# Altium schematic sheet som.SchDoc
size 420 x 297 mm
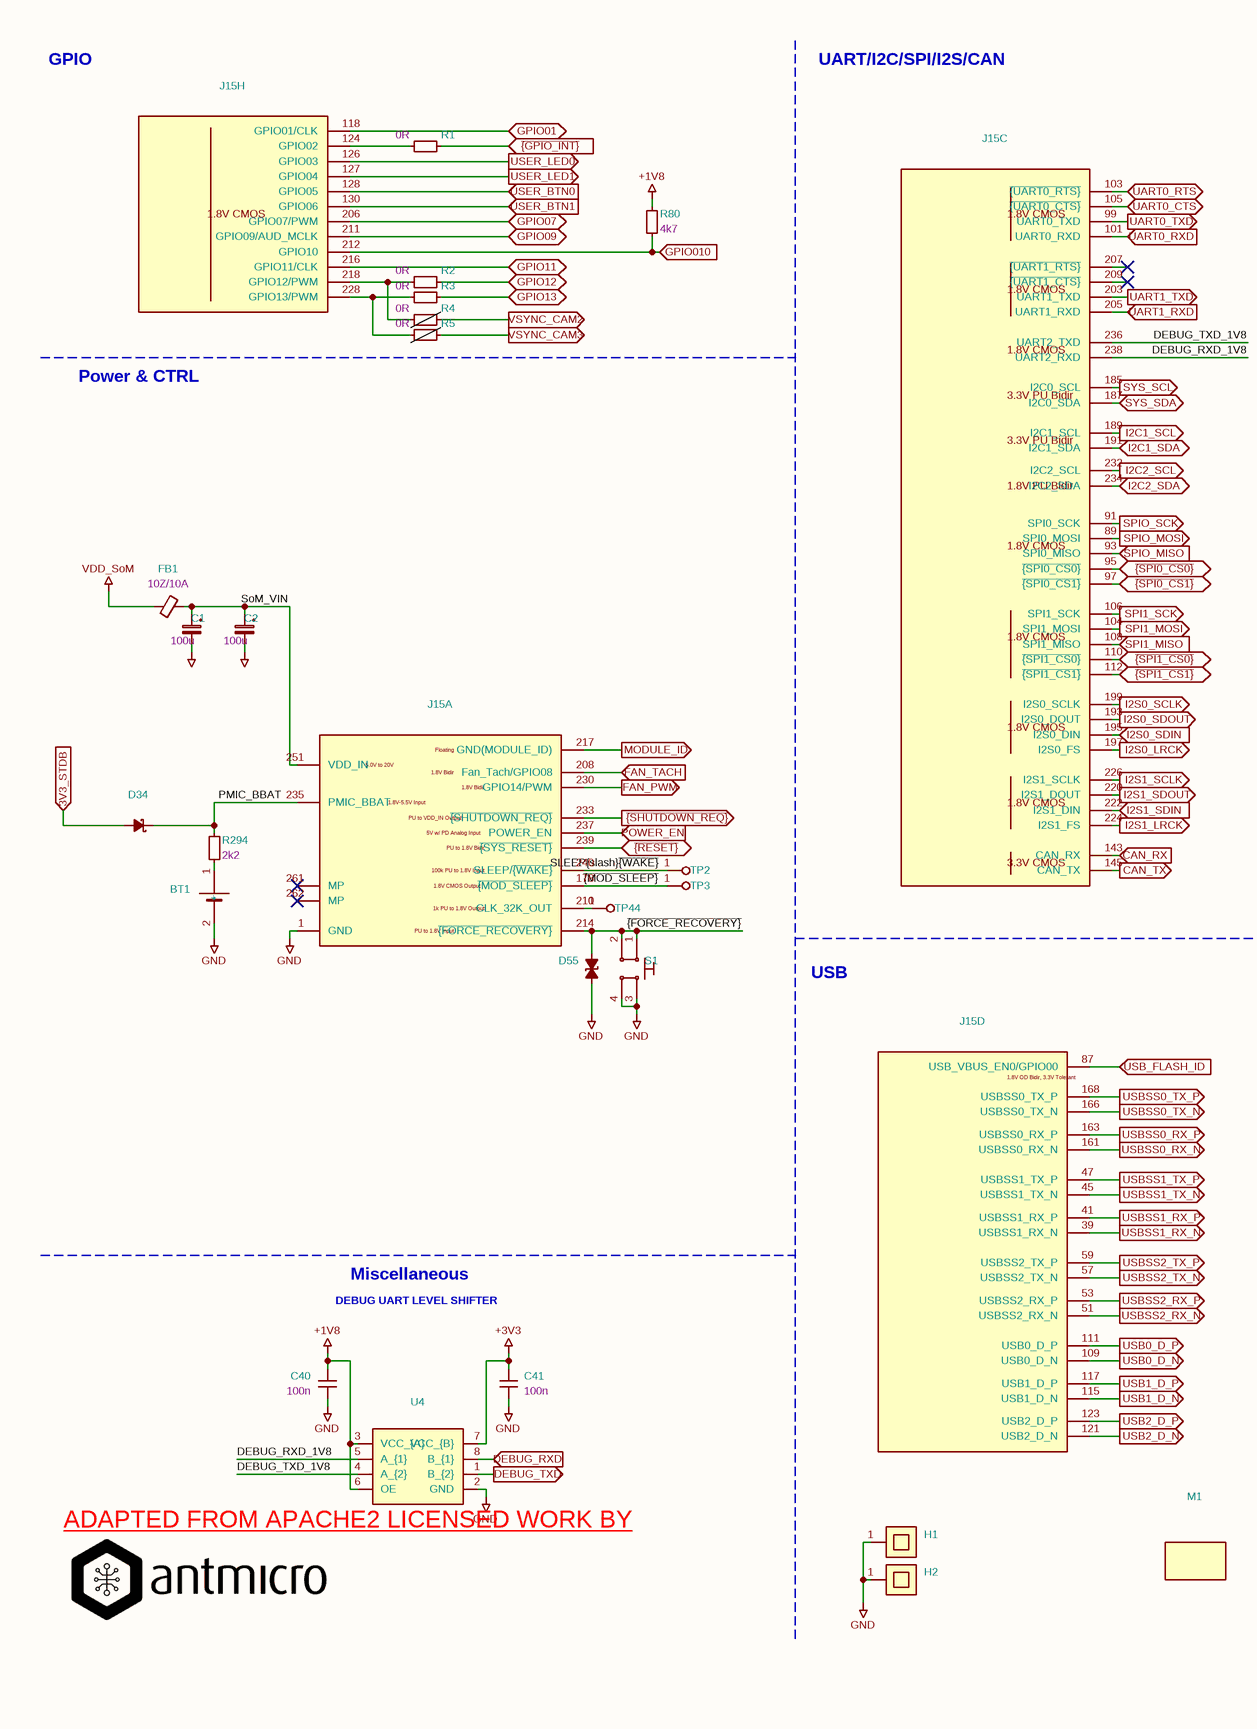
[diagram p0: som.SchDoc, left]
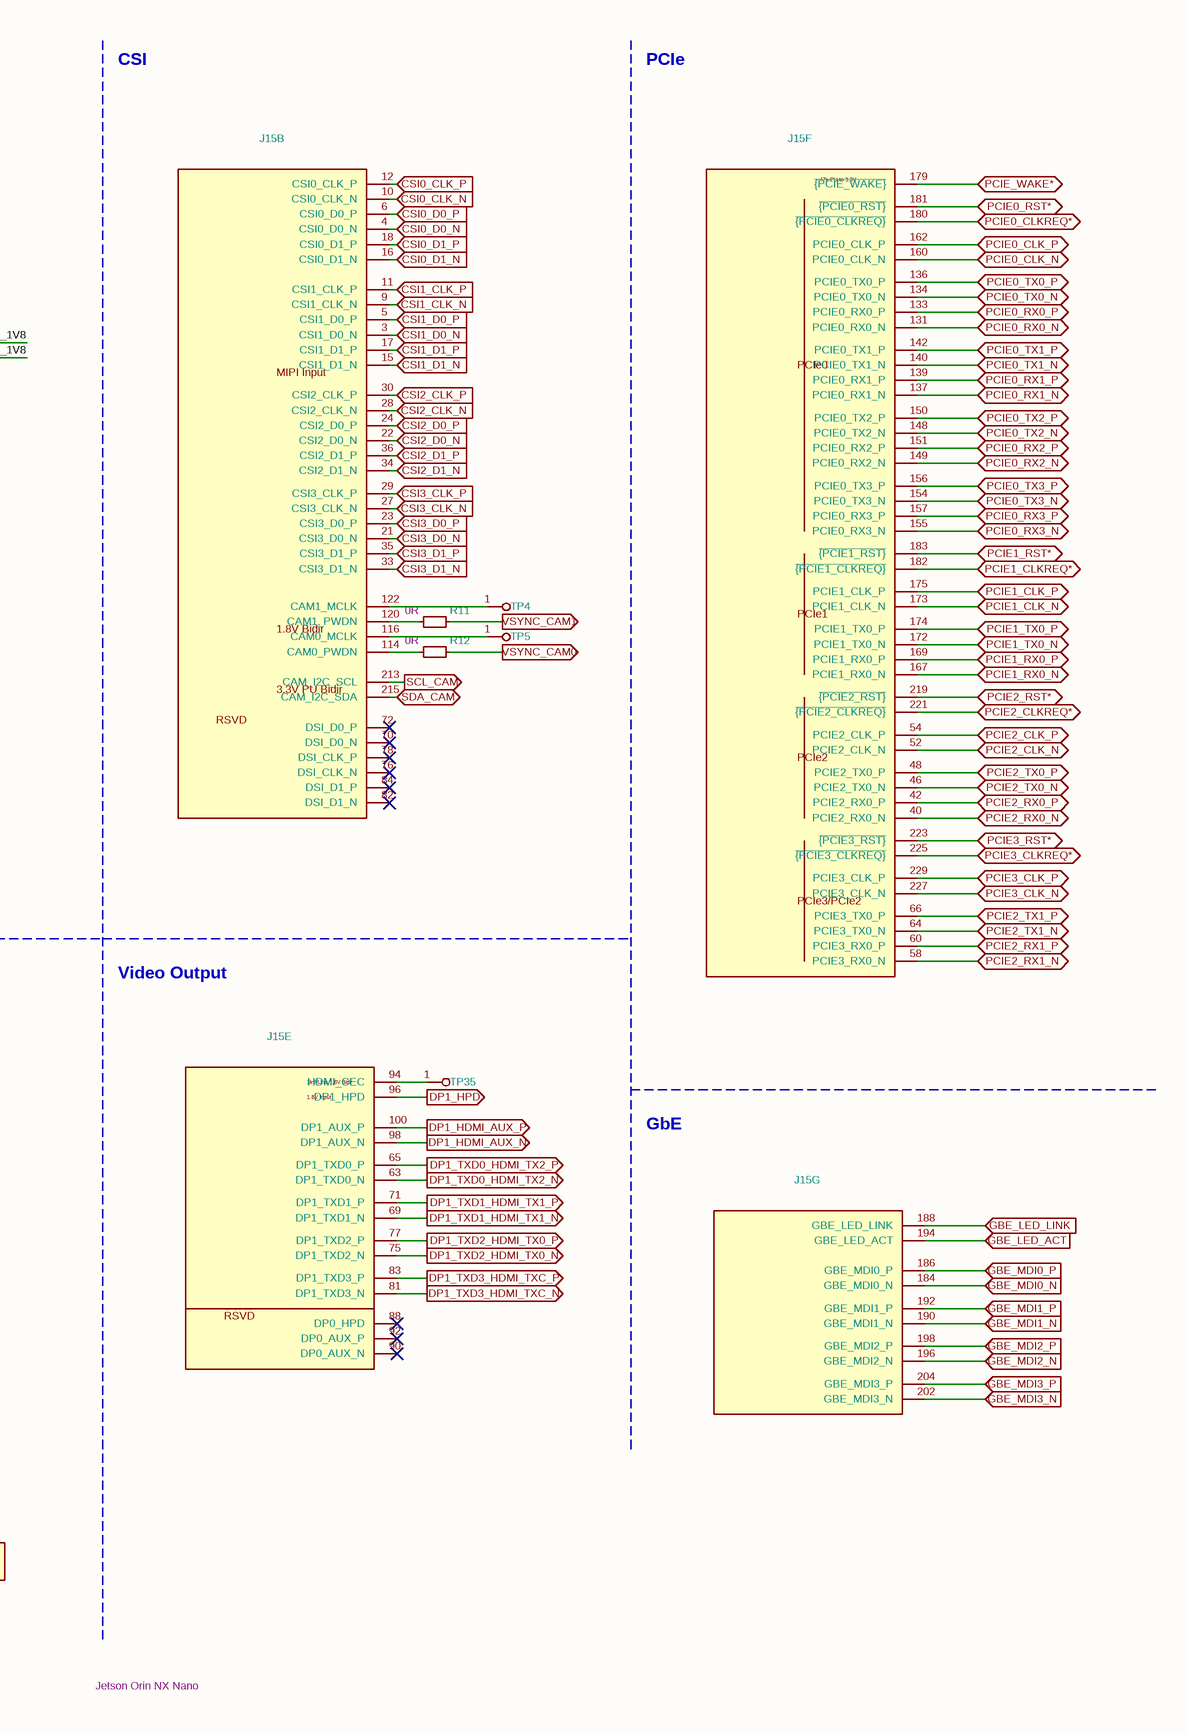
[diagram p1: som.SchDoc, right]

## Parts
BT1  MS621FE-FL11E  [MS621FE-FL11E]  (value not drawn)
C1  Val: 100u  [C_Pol_EIA-X]  (hidden comment: T521D107M025ATE040)
C2  Val: 100u  [C_Pol_EIA-X]  (hidden comment: T521D107M025ATE040)
C40  Val: 100n  [C_0402_1005Metric]  (hidden comment: GRM155R61H104KE14D)
C41  Val: 100n  [C_0402_1005Metric]  (hidden comment: GRM155R61H104KE14D)
D34  RB521S30T1G  [SOD-523]  (value not drawn)
D55  TPD1E0B04DPYR  [XDFN-2_1x0.60mm]  (value not drawn)
FB1  Val: 10Z/10A  [FB_1206_3216Metric]  (hidden comment: 74279221100)
H1  9774065151R  [Spacer_Drill3.7mm_H6.5mm_9774065151R]  (value not drawn)
H2  9774065151R  [Spacer_Drill3.7mm_H6.5mm_9774065151R]  (value not drawn)
J15  2309413-1  [TE_2309413]  (value not drawn)  (parts A,B,C,D,E,F,G,H of 8)
M1  Displayed name: Jetson Orin NX Nano  [Module_Jetson-Orin-NX-Nano]  (hidden comment: 900-13767-0000-000)  (mechanical)
R1  Val: 0R  [R_0402_1005Metric]  (hidden comment: ERJ2GE0R00X)
R2  Val: 0R  [R_0402_1005Metric]  (hidden comment: ERJ2GE0R00X)
R3  Val: 0R  [R_0402_1005Metric]  (hidden comment: ERJ2GE0R00X)
R4  Val: 0R  [R_0402_1005Metric]  (hidden comment: ERJ2GE0R00X)  (no BOM)
R5  Val: 0R  [R_0402_1005Metric]  (hidden comment: ERJ2GE0R00X)  (no BOM)
R11  Val: 0R  [R_0402_1005Metric]  (hidden comment: ERJ2GE0R00X)
R12  Val: 0R  [R_0402_1005Metric]  (hidden comment: ERJ2GE0R00X)
R80  Val: 4k7  [R_0402_1005Metric]  (hidden comment: CR0402-FX-4701GLF)
R294  Val: 2k2  [R_0402_1005Metric]  (hidden comment: CR0402-FX-2201GLF)
S1  KMR211NGLFS  [SW_KMR211NGLFS_SMD]  (value not drawn)
TP2  TP_0.75mm_SMD  [TP_SMD_0.75mm]  (value not drawn)  (no BOM)
TP3  TP_0.75mm_SMD  [TP_SMD_0.75mm]  (value not drawn)  (no BOM)
TP4  TP_0.75mm_SMD  [TP_SMD_0.75mm]  (value not drawn)  (no BOM)
TP5  TP_0.75mm_SMD  [TP_SMD_0.75mm]  (value not drawn)  (no BOM)
TP35  TP_0.75mm_SMD  [TP_SMD_0.75mm]  (value not drawn)  (no BOM)
TP44  TP_0.75mm_SMD  [TP_SMD_0.75mm]  (value not drawn)  (no BOM)
U4  NTS0102GT  [XSON-8_1x1.95mm_P0.5mm]  (value not drawn)

## Ports
3V3_STDB (in), CAN_RX (in), CAN_TX (out), CSI0_CLK_N (in), CSI0_CLK_P (in), CSI0_D0_N (in), CSI0_D0_P (in), CSI0_D1_N (in), CSI0_D1_P (in), CSI1_CLK_N (in), CSI1_CLK_P (in), CSI1_D0_N (in), CSI1_D0_P (in), CSI1_D1_N (in), CSI1_D1_P (in), CSI2_CLK_N (in), CSI2_CLK_P (in), CSI2_D0_N (in), CSI2_D0_P (in), CSI2_D1_N (in), CSI2_D1_P (in), CSI3_CLK_N (in), CSI3_CLK_P (in), CSI3_D0_N (in), CSI3_D0_P (in), CSI3_D1_N (in), CSI3_D1_P (in), DEBUG_RXD (in), DEBUG_TXD (out), DP1_HDMI_AUX_N (out), DP1_HDMI_AUX_P (out), DP1_HPD (out), DP1_TXD0_HDMI_TX2_N (out), DP1_TXD0_HDMI_TX2_P (out), DP1_TXD1_HDMI_TX1_N (out), DP1_TXD1_HDMI_TX1_P (out), DP1_TXD2_HDMI_TX0_N (out), DP1_TXD2_HDMI_TX0_P (out), DP1_TXD3_HDMI_TXC_N (out), DP1_TXD3_HDMI_TXC_P (out), FAN_PWM (out), FAN_TACH (in), GBE_LED_ACT (in), GBE_LED_LINK (in), GBE_MDI0_N (in), GBE_MDI0_P (in), GBE_MDI1_N (in), GBE_MDI1_P (in), GBE_MDI2_N (in), GBE_MDI2_P (in), GBE_MDI3_N (in), GBE_MDI3_P (in), GPIO01 (bidir), GPIO07 (bidir), GPIO09 (bidir), GPIO010 (in), GPIO11 (bidir), GPIO12 (bidir), GPIO13 (bidir), I2C1_SCL (out), I2C1_SDA (bidir), I2C2_SCL (out), I2C2_SDA (bidir), I2S0_LRCK (out), I2S0_SCLK (out), I2S0_SDIN (in), I2S0_SDOUT (out), I2S1_LRCK (out), I2S1_SCLK (out), I2S1_SDIN (in), I2S1_SDOUT (out), MODULE_ID (out), PCIE0_CLK_N (bidir), PCIE0_CLK_P (bidir), PCIE0_CLKREQ* (bidir), PCIE0_RST* (bidir), PCIE0_RX0_N (bidir), PCIE0_RX0_P (bidir), PCIE0_RX1_N (bidir), PCIE0_RX1_P (bidir), PCIE0_RX2_N (bidir), PCIE0_RX2_P (bidir), PCIE0_RX3_N (bidir), PCIE0_RX3_P (bidir), PCIE0_TX0_N (bidir), PCIE0_TX0_P (bidir), PCIE0_TX1_N (bidir), PCIE0_TX1_P (bidir), PCIE0_TX2_N (bidir), PCIE0_TX2_P (bidir), PCIE0_TX3_N (bidir), PCIE0_TX3_P (bidir), PCIE1_CLK_N (bidir), PCIE1_CLK_P (bidir), PCIE1_CLKREQ* (bidir), PCIE1_RST* (bidir), PCIE1_RX0_N (bidir), PCIE1_RX0_P (bidir), PCIE1_TX0_N (bidir), PCIE1_TX0_P (bidir), PCIE2_CLK_N (bidir), PCIE2_CLK_P (bidir), PCIE2_CLKREQ* (bidir), PCIE2_RST* (bidir), PCIE2_RX0_N (bidir), PCIE2_RX0_P (bidir), PCIE2_RX1_N (bidir), PCIE2_RX1_P (bidir), PCIE2_TX0_N (bidir), PCIE2_TX0_P (bidir), PCIE2_TX1_N (bidir), PCIE2_TX1_P (bidir), PCIE3_CLK_N (bidir), PCIE3_CLK_P (bidir), PCIE3_CLKREQ* (bidir), PCIE3_RST* (bidir), PCIE_WAKE* (bidir), POWER_EN (in), SCL_CAM (out), SDA_CAM (bidir), SPI1_MISO (in), SPI1_MOSI (out), SPI1_SCK (out), SPIO_MISO (in), SPIO_MOSI (out), SPIO_SCK (out), SYS_SCL (out), SYS_SDA (bidir), UART0_CTS (bidir), UART0_RTS (bidir), UART0_RXD (in), UART0_TXD (out), UART1_RXD (in), UART1_TXD (out), USB0_D_N (out), USB0_D_P (out), USB1_D_N (out), USB1_D_P (out), USB2_D_N (out), USB2_D_P (out), USB_FLASH_ID (in), USBSS0_RX_N (out), USBSS0_RX_P (out), USBSS0_TX_N (out), USBSS0_TX_P (out), USBSS1_RX_N (out), USBSS1_RX_P (out), USBSS1_TX_N (out), USBSS1_TX_P (out), USBSS2_RX_N (out), USBSS2_RX_P (out), USBSS2_TX_N (out), USBSS2_TX_P (out), USER_BTN0 (in), USER_BTN1 (in), USER_LED0 (out), USER_LED1 (out), VSYNC_CAM0 (out), VSYNC_CAM1 (out), VSYNC_CAM2 (out), VSYNC_CAM3 (out), ~{{GPIO_INT}} (in), ~{{RESET}} (bidir), ~{{SHUTDOWN_REQ}} (out), ~{{SPI0_CS0}} (bidir), ~{{SPI0_CS1}} (bidir), ~{{SPI1_CS0}} (bidir), ~{{SPI1_CS1}} (bidir)

## Nets
+1V8: C40.2 R80.2 U4.3(VCC_{A}) U4.6(OE)
+3V3: C41.2 U4.7(VCC_{B})
GND: BT1.2(-) C1.2 C2.2 C40.1 C41.1 D55.1(C) H1.1 H2.1 J15.1(GND) S1.3 S1.4 U4.2(GND)
VDD_SoM: FB1.1
3V3_STDB: D34.2(A) ; port 3V3_STDB
CAN_RX: J15.143(CAN_RX) ; port CAN_RX
CAN_TX: J15.145(CAN_TX) ; port CAN_TX
CSI0_CLK_N: J15.10(CSI0_CLK_N) ; port CSI0_CLK_N
CSI0_CLK_P: J15.12(CSI0_CLK_P) ; port CSI0_CLK_P
CSI0_D0_N: J15.4(CSI0_D0_N) ; port CSI0_D0_N
CSI0_D0_P: J15.6(CSI0_D0_P) ; port CSI0_D0_P
CSI0_D1_N: J15.16(CSI0_D1_N) ; port CSI0_D1_N
CSI0_D1_P: J15.18(CSI0_D1_P) ; port CSI0_D1_P
CSI1_CLK_N: J15.9(CSI1_CLK_N) ; port CSI1_CLK_N
CSI1_CLK_P: J15.11(CSI1_CLK_P) ; port CSI1_CLK_P
CSI1_D0_N: J15.3(CSI1_D0_N) ; port CSI1_D0_N
CSI1_D0_P: J15.5(CSI1_D0_P) ; port CSI1_D0_P
CSI1_D1_N: J15.15(CSI1_D1_N) ; port CSI1_D1_N
CSI1_D1_P: J15.17(CSI1_D1_P) ; port CSI1_D1_P
CSI2_CLK_N: J15.28(CSI2_CLK_N) ; port CSI2_CLK_N
CSI2_CLK_P: J15.30(CSI2_CLK_P) ; port CSI2_CLK_P
CSI2_D0_N: J15.22(CSI2_D0_N) ; port CSI2_D0_N
CSI2_D0_P: J15.24(CSI2_D0_P) ; port CSI2_D0_P
CSI2_D1_N: J15.34(CSI2_D1_N) ; port CSI2_D1_N
CSI2_D1_P: J15.36(CSI2_D1_P) ; port CSI2_D1_P
CSI3_CLK_N: J15.27(CSI3_CLK_N) ; port CSI3_CLK_N
CSI3_CLK_P: J15.29(CSI3_CLK_P) ; port CSI3_CLK_P
CSI3_D0_N: J15.21(CSI3_D0_N) ; port CSI3_D0_N
CSI3_D0_P: J15.23(CSI3_D0_P) ; port CSI3_D0_P
CSI3_D1_N: J15.33(CSI3_D1_N) ; port CSI3_D1_N
CSI3_D1_P: J15.35(CSI3_D1_P) ; port CSI3_D1_P
DEBUG_RXD: U4.8(B_{1}) ; port DEBUG_RXD
DEBUG_RXD_1V8: J15.238(UART2_RXD) U4.5(A_{1})
DEBUG_TXD: U4.1(B_{2}) ; port DEBUG_TXD
DEBUG_TXD_1V8: J15.236(UART2_TXD) U4.4(A_{2})
DP1_HDMI_AUX_N: J15.98(DP1_AUX_N) ; port DP1_HDMI_AUX_N
DP1_HDMI_AUX_P: J15.100(DP1_AUX_P) ; port DP1_HDMI_AUX_P
DP1_HPD: J15.96(DP1_HPD) ; port DP1_HPD
DP1_TXD0_HDMI_TX2_N: J15.63(DP1_TXD0_N) ; port DP1_TXD0_HDMI_TX2_N
DP1_TXD0_HDMI_TX2_P: J15.65(DP1_TXD0_P) ; port DP1_TXD0_HDMI_TX2_P
DP1_TXD1_HDMI_TX1_N: J15.69(DP1_TXD1_N) ; port DP1_TXD1_HDMI_TX1_N
DP1_TXD1_HDMI_TX1_P: J15.71(DP1_TXD1_P) ; port DP1_TXD1_HDMI_TX1_P
DP1_TXD2_HDMI_TX0_N: J15.75(DP1_TXD2_N) ; port DP1_TXD2_HDMI_TX0_N
DP1_TXD2_HDMI_TX0_P: J15.77(DP1_TXD2_P) ; port DP1_TXD2_HDMI_TX0_P
DP1_TXD3_HDMI_TXC_N: J15.81(DP1_TXD3_N) ; port DP1_TXD3_HDMI_TXC_N
DP1_TXD3_HDMI_TXC_P: J15.83(DP1_TXD3_P) ; port DP1_TXD3_HDMI_TXC_P
FAN_PWM: J15.230(GPIO14/PWM) ; port FAN_PWM
FAN_TACH: J15.208(Fan_Tach/GPIO08) ; port FAN_TACH
GBE_LED_ACT: J15.194(GBE_LED_ACT) ; port GBE_LED_ACT
GBE_LED_LINK: J15.188(GBE_LED_LINK) ; port GBE_LED_LINK
GBE_MDI0_N: J15.184(GBE_MDI0_N) ; port GBE_MDI0_N
GBE_MDI0_P: J15.186(GBE_MDI0_P) ; port GBE_MDI0_P
GBE_MDI1_N: J15.190(GBE_MDI1_N) ; port GBE_MDI1_N
GBE_MDI1_P: J15.192(GBE_MDI1_P) ; port GBE_MDI1_P
GBE_MDI2_N: J15.196(GBE_MDI2_N) ; port GBE_MDI2_N
GBE_MDI2_P: J15.198(GBE_MDI2_P) ; port GBE_MDI2_P
GBE_MDI3_N: J15.202(GBE_MDI3_N) ; port GBE_MDI3_N
GBE_MDI3_P: J15.204(GBE_MDI3_P) ; port GBE_MDI3_P
GPIO01: J15.118(GPIO01/CLK) ; port GPIO01
GPIO07: J15.206(GPIO07/PWM) ; port GPIO07
GPIO09: J15.211(GPIO09/AUD_MCLK) ; port GPIO09
GPIO010: J15.212(GPIO10) R80.1 ; port GPIO010
GPIO11: J15.216(GPIO11/CLK) ; port GPIO11
GPIO12: R2.2 ; port GPIO12
GPIO13: R3.2 ; port GPIO13
I2C1_SCL: J15.189(I2C1_SCL) ; port I2C1_SCL
I2C1_SDA: J15.191(I2C1_SDA) ; port I2C1_SDA
I2C2_SCL: J15.232(I2C2_SCL) ; port I2C2_SCL
I2C2_SDA: J15.234(I2C2_SDA) ; port I2C2_SDA
I2S0_LRCK: J15.197(I2S0_FS) ; port I2S0_LRCK
I2S0_SCLK: J15.199(I2S0_SCLK) ; port I2S0_SCLK
I2S0_SDIN: J15.195(I2S0_DIN) ; port I2S0_SDIN
I2S0_SDOUT: J15.193(I2S0_DOUT) ; port I2S0_SDOUT
I2S1_LRCK: J15.224(I2S1_FS) ; port I2S1_LRCK
I2S1_SCLK: J15.226(I2S1_SCLK) ; port I2S1_SCLK
I2S1_SDIN: J15.222(I2S1_DIN) ; port I2S1_SDIN
I2S1_SDOUT: J15.220(I2S1_DOUT) ; port I2S1_SDOUT
MODULE_ID: J15.217(GND(MODULE_ID)) ; port MODULE_ID
PCIE0_CLK_N: J15.160(PCIE0_CLK_N) ; port PCIE0_CLK_N
PCIE0_CLK_P: J15.162(PCIE0_CLK_P) ; port PCIE0_CLK_P
PCIE0_CLKREQ*: J15.180(~{{PCIE0_CLKREQ}}) ; port PCIE0_CLKREQ*
PCIE0_RST*: J15.181(~{{PCIE0_RST}}) ; port PCIE0_RST*
PCIE0_RX0_N: J15.131(PCIE0_RX0_N) ; port PCIE0_RX0_N
PCIE0_RX0_P: J15.133(PCIE0_RX0_P) ; port PCIE0_RX0_P
PCIE0_RX1_N: J15.137(PCIE0_RX1_N) ; port PCIE0_RX1_N
PCIE0_RX1_P: J15.139(PCIE0_RX1_P) ; port PCIE0_RX1_P
PCIE0_RX2_N: J15.149(PCIE0_RX2_N) ; port PCIE0_RX2_N
PCIE0_RX2_P: J15.151(PCIE0_RX2_P) ; port PCIE0_RX2_P
PCIE0_RX3_N: J15.155(PCIE0_RX3_N) ; port PCIE0_RX3_N
PCIE0_RX3_P: J15.157(PCIE0_RX3_P) ; port PCIE0_RX3_P
PCIE0_TX0_N: J15.134(PCIE0_TX0_N) ; port PCIE0_TX0_N
PCIE0_TX0_P: J15.136(PCIE0_TX0_P) ; port PCIE0_TX0_P
PCIE0_TX1_N: J15.140(PCIE0_TX1_N) ; port PCIE0_TX1_N
PCIE0_TX1_P: J15.142(PCIE0_TX1_P) ; port PCIE0_TX1_P
PCIE0_TX2_N: J15.148(PCIE0_TX2_N) ; port PCIE0_TX2_N
PCIE0_TX2_P: J15.150(PCIE0_TX2_P) ; port PCIE0_TX2_P
PCIE0_TX3_N: J15.154(PCIE0_TX3_N) ; port PCIE0_TX3_N
PCIE0_TX3_P: J15.156(PCIE0_TX3_P) ; port PCIE0_TX3_P
PCIE1_CLK_N: J15.173(PCIE1_CLK_N) ; port PCIE1_CLK_N
PCIE1_CLK_P: J15.175(PCIE1_CLK_P) ; port PCIE1_CLK_P
PCIE1_CLKREQ*: J15.182(~{{PCIE1_CLKREQ}}) ; port PCIE1_CLKREQ*
PCIE1_RST*: J15.183(~{{PCIE1_RST}}) ; port PCIE1_RST*
PCIE1_RX0_N: J15.167(PCIE1_RX0_N) ; port PCIE1_RX0_N
PCIE1_RX0_P: J15.169(PCIE1_RX0_P) ; port PCIE1_RX0_P
PCIE1_TX0_N: J15.172(PCIE1_TX0_N) ; port PCIE1_TX0_N
PCIE1_TX0_P: J15.174(PCIE1_TX0_P) ; port PCIE1_TX0_P
PCIE2_CLK_N: J15.52(PCIE2_CLK_N) ; port PCIE2_CLK_N
PCIE2_CLK_P: J15.54(PCIE2_CLK_P) ; port PCIE2_CLK_P
PCIE2_CLKREQ*: J15.221(~{{PCIE2_CLKREQ}}) ; port PCIE2_CLKREQ*
PCIE2_RST*: J15.219(~{{PCIE2_RST}}) ; port PCIE2_RST*
PCIE2_RX0_N: J15.40(PCIE2_RX0_N) ; port PCIE2_RX0_N
PCIE2_RX0_P: J15.42(PCIE2_RX0_P) ; port PCIE2_RX0_P
PCIE2_RX1_N: J15.58(PCIE3_RX0_N) ; port PCIE2_RX1_N
PCIE2_RX1_P: J15.60(PCIE3_RX0_P) ; port PCIE2_RX1_P
PCIE2_TX0_N: J15.46(PCIE2_TX0_N) ; port PCIE2_TX0_N
PCIE2_TX0_P: J15.48(PCIE2_TX0_P) ; port PCIE2_TX0_P
PCIE2_TX1_N: J15.64(PCIE3_TX0_N) ; port PCIE2_TX1_N
PCIE2_TX1_P: J15.66(PCIE3_TX0_P) ; port PCIE2_TX1_P
PCIE3_CLK_N: J15.227(PCIE3_CLK_N) ; port PCIE3_CLK_N
PCIE3_CLK_P: J15.229(PCIE3_CLK_P) ; port PCIE3_CLK_P
PCIE3_CLKREQ*: J15.225(~{{PCIE3_CLKREQ}}) ; port PCIE3_CLKREQ*
PCIE3_RST*: J15.223(~{{PCIE3_RST}}) ; port PCIE3_RST*
PCIE_WAKE*: J15.179(~{{PCIE_WAKE}}) ; port PCIE_WAKE*
PMIC_BBAT: D34.1(C) J15.235(PMIC_BBAT) R294.2
POWER_EN: J15.237(POWER_EN) ; port POWER_EN
SCL_CAM: J15.213(CAM_I2C_SCL) ; port SCL_CAM
SDA_CAM: J15.215(CAM_I2C_SDA) ; port SDA_CAM
SLEEP{slash}~{{WAKE}}: J15.240(SLEEP/~{{WAKE}}) TP2.1
SoM_VIN: C1.1 C2.1 FB1.2 J15.251(VDD_IN)
SPI1_MISO: J15.108(SPI1_MISO) ; port SPI1_MISO
SPI1_MOSI: J15.104(SPI1_MOSI) ; port SPI1_MOSI
SPI1_SCK: J15.106(SPI1_SCK) ; port SPI1_SCK
SPIO_MISO: J15.93(SPI0_MISO) ; port SPIO_MISO
SPIO_MOSI: J15.89(SPI0_MOSI) ; port SPIO_MOSI
SPIO_SCK: J15.91(SPI0_SCK) ; port SPIO_SCK
SYS_SCL: J15.185(I2C0_SCL) ; port SYS_SCL
SYS_SDA: J15.187(I2C0_SDA) ; port SYS_SDA
UART0_CTS: J15.105(~{{UART0_CTS}}) ; port UART0_CTS
UART0_RTS: J15.103(~{{UART0_RTS}}) ; port UART0_RTS
UART0_RXD: J15.101(UART0_RXD) ; port UART0_RXD
UART0_TXD: J15.99(UART0_TXD) ; port UART0_TXD
UART1_RXD: J15.205(UART1_RXD) ; port UART1_RXD
UART1_TXD: J15.203(UART1_TXD) ; port UART1_TXD
USB0_D_N: J15.109(USB0_D_N) ; port USB0_D_N
USB0_D_P: J15.111(USB0_D_P) ; port USB0_D_P
USB1_D_N: J15.115(USB1_D_N) ; port USB1_D_N
USB1_D_P: J15.117(USB1_D_P) ; port USB1_D_P
USB2_D_N: J15.121(USB2_D_N) ; port USB2_D_N
USB2_D_P: J15.123(USB2_D_P) ; port USB2_D_P
USB_FLASH_ID: J15.87(USB_VBUS_EN0/GPIO00) ; port USB_FLASH_ID
USBSS0_RX_N: J15.161(USBSS0_RX_N) ; port USBSS0_RX_N
USBSS0_RX_P: J15.163(USBSS0_RX_P) ; port USBSS0_RX_P
USBSS0_TX_N: J15.166(USBSS0_TX_N) ; port USBSS0_TX_N
USBSS0_TX_P: J15.168(USBSS0_TX_P) ; port USBSS0_TX_P
USBSS1_RX_N: J15.39(USBSS1_RX_N) ; port USBSS1_RX_N
USBSS1_RX_P: J15.41(USBSS1_RX_P) ; port USBSS1_RX_P
USBSS1_TX_N: J15.45(USBSS1_TX_N) ; port USBSS1_TX_N
USBSS1_TX_P: J15.47(USBSS1_TX_P) ; port USBSS1_TX_P
USBSS2_RX_N: J15.51(USBSS2_RX_N) ; port USBSS2_RX_N
USBSS2_RX_P: J15.53(USBSS2_RX_P) ; port USBSS2_RX_P
USBSS2_TX_N: J15.57(USBSS2_TX_N) ; port USBSS2_TX_N
USBSS2_TX_P: J15.59(USBSS2_TX_P) ; port USBSS2_TX_P
USER_BTN0: J15.128(GPIO05) ; port USER_BTN0
USER_BTN1: J15.130(GPIO06) ; port USER_BTN1
USER_LED0: J15.126(GPIO03) ; port USER_LED0
USER_LED1: J15.127(GPIO04) ; port USER_LED1
VSYNC_CAM0: R12.2 ; port VSYNC_CAM0
VSYNC_CAM1: R11.2 ; port VSYNC_CAM1
VSYNC_CAM2: R4.2 ; port VSYNC_CAM2
VSYNC_CAM3: R5.2 ; port VSYNC_CAM3
~{{FORCE_RECOVERY}}: D55.2(A) J15.214(~{{FORCE_RECOVERY}}) S1.1 S1.2
~{{GPIO_INT}}: R1.2 ; port ~{{GPIO_INT}}
~{{MOD_SLEEP}}: J15.178(~{{MOD_SLEEP}}) TP3.1
~{{RESET}}: J15.239(~{{SYS_RESET}}) ; port ~{{RESET}}
~{{SHUTDOWN_REQ}}: J15.233(~{{SHUTDOWN_REQ}}) ; port ~{{SHUTDOWN_REQ}}
~{{SPI0_CS0}}: J15.95(~{{SPI0_CS0}}) ; port ~{{SPI0_CS0}}
~{{SPI0_CS1}}: J15.97(~{{SPI0_CS1}}) ; port ~{{SPI0_CS1}}
~{{SPI1_CS0}}: J15.110(~{{SPI1_CS0}}) ; port ~{{SPI1_CS0}}
~{{SPI1_CS1}}: J15.112(~{{SPI1_CS1}}) ; port ~{{SPI1_CS1}}
NetBT1_1: BT1.1(+) R294.1
NetJ15_94: J15.94(HDMI_CEC) TP35.1
NetJ15_114: J15.114(CAM0_PWDN) R12.1
NetJ15_116: J15.116(CAM0_MCLK) TP5.1
NetJ15_120: J15.120(CAM1_PWDN) R11.1
NetJ15_122: J15.122(CAM1_MCLK) TP4.1
NetJ15_124: J15.124(GPIO02) R1.1
NetJ15_210: J15.210(CLK_32K_OUT) TP44.1
NetJ15_218: J15.218(GPIO12/PWM) R2.1 R4.1
NetJ15_228: J15.228(GPIO13/PWM) R3.1 R5.1

Not connected (* = marked no-connect by the designer): J15 2(GND) 7(GND) 8(GND) 13(GND) 14(GND) 19(GND) 20(GND) 25(GND) 26(GND) 31(GND) 32(GND) 37(GND) 38(GND) 43(GND) 44(GND) 49(GND) 50(GND) 55(GND) 56(GND) 61(GND) 62(GND) 67(GND) 68(GND) 70(DSI_D0_N)* 72(DSI_D0_P)* 73(GND) 74(GND) 76(DSI_CLK_N)* 78(DSI_CLK_P)* 79(GND) 80(GND) 82(DSI_D1_N)* 84(DSI_D1_P)* 85(GND) 86(GND) 88(DP0_HPD)* 90(DP0_AUX_N)* 92(DP0_AUX_P)* 102(GND) 107(GND) 113(GND) 119(GND) 125(GND) 129(GND) 132(GND) 135(GND) 138(GND) 141(GND) 144(GND) 146(GND) 147(GND) 152(GND) 153(GND) 158(GND) 159(GND) 164(GND) 165(GND) 170(GND) 171(GND) 176(GND) 177(GND) 200(GND) 201(GND) 207(~{{UART1_RTS}})* 209(~{{UART1_CTS}})* 231(GND) 241(GND) 242(GND) 243(GND) 244(GND) 245(GND) 246(GND) 247(GND) 248(GND) 249(GND) 250(GND) 252(VDD_IN) 253(VDD_IN) 254(VDD_IN) 255(VDD_IN) 256(VDD_IN) 257(VDD_IN) 258(VDD_IN) 259(VDD_IN) 260(VDD_IN) 261(MP)* 262(MP)*

## Notes on the sheet
- GPIO
- UART/I2C/SPI/I2S/CAN
- CSI
- PCIe
- Power & CTRL
- USB
- Video Output
- GbE
- DEBUG UART LEVEL SHIFTER
- Miscellaneous
- (near U4) ADAPTED FROM APACHE2 LICENSED WORK BY <https://github.com/antmicro/jetson-orin-baseboard>
- 1
- 2
- 3
- 4
- 5
- 6
- 7
- 8
- A
- B
- C
- D
- E
- www.antmicro.com <http://www.antmicro.com>
- Title: Jetson Orin Baseboard
- File: som.kicad_sch
- Sheet: /
- Antmicro Ltd
- F
- KiCad E.D.A.  kicad (5.1.4)-1
- Size: A3
- Date: 2025-01-15
- Rev: 1.3.0
- Id: 1/1
- (in symbol Bus_DDR4_SODIMM_CUSTOM_Jetson-Orin-H9.2mm-socket, part A) Floating; 5.0V to 20V; 1.8V Bidir; 1.8V-5.5V Input; PU to VDD_IN Output; 5V w/ PD Analog Input; PU to 1.8V Bidir; 100k PU to 1.8V Input; 1.8V CMOS Output; 1k PU to 1.8V Output; PU to 1.8V Input
- (in symbol Bus_DDR4_SODIMM_CUSTOM_Jetson-Orin-H9.2mm-socket, part B) MIPI Input; 1.8V Bidir; 3.3V PU Bidir; RSVD
- (in symbol Bus_DDR4_SODIMM_CUSTOM_Jetson-Orin-H9.2mm-socket, part C) 1.8V CMOS; 3.3V PU Bidir; 1.8V PU Bidir; 3.3V CMOS
- (in symbol Bus_DDR4_SODIMM_CUSTOM_Jetson-Orin-H9.2mm-socket, part D) 1.8V OD Bidir, 3.3V Tolerant
- (in symbol Bus_DDR4_SODIMM_CUSTOM_Jetson-Orin-H9.2mm-socket, part E) 1k PU to 1.8V Bidir; 1.8V Input; RSVD
- (in symbol Bus_DDR4_SODIMM_CUSTOM_Jetson-Orin-H9.2mm-socket, part F) 47k PU to 3.3V; PCIe0; PCIe1; PCIe2; PCIe3/PCIe2
- (in symbol Bus_DDR4_SODIMM_CUSTOM_Jetson-Orin-H9.2mm-socket, part H) 1.8V CMOS

## Library data of the parts
BT1 = Battery_Holder_MS621FE-FL11E: Manufacturer 1: Seiko Instruments; License: Apache-2.0; Author: Antmicro; OldValue: Battery_Holder_MS621FE-FL11E; Manufacturer Part Number 1: MS621FE-FL11E; Value: MS621FE-FL11E; Footprint: antmicro-footprints:MS621FE-FL11E
C1 C2 = C_Pol_100u_25V_KEMET-T521-D-107: Manufacturer 1: KEMET; License: Apache-2.0; Voltage: 25V; Dielectric: template_dielectric; Author: Antmicro; OldValue: C_Pol_100u_25V_KEMET-T521-D-107; Manufacturer Part Number 1: T521D107M025ATE040; Value: T521D107M025ATE040; Footprint: antmicro-footprints:C_Pol_EIA-X
C40 C41 = C_100n_0402: Manufacturer 1: Murata; License: Apache-2.0; Voltage: 50V; Dielectric: X5R; Author: Antmicro; OldValue: C_100n_0402; Manufacturer Part Number 1: GRM155R61H104KE14D; Value: GRM155R61H104KE14D; Footprint: antmicro-footprints:C_0402_1005Metric
D34 = RB521S30T1G: Manufacturer 1: ON Semiconductor; License: Apache-2.0; Author: Antmicro; OldValue: RB521S30T1G; Manufacturer Part Number 1: RB521S30T1G; Value: RB521S30T1G; Footprint: antmicro-footprints:SOD-523
D55 = TPD1E0B04_XDFN-2: Manufacturer 1: Texas Instruments; License: Apache-2.0; Author: Antmicro; OldValue: TPD1E0B04_XDFN-2; Manufacturer Part Number 1: TPD1E0B04DPYR; Value: TPD1E0B04DPYR; Footprint: antmicro-footprints:XDFN-2_1x0.60mm
FB1 = FB_10Z_10A_WE-MPSB_1206: Manufacturer 1: Würth Elektronik; License: Apache-2.0; Author: Antmicro; OldValue: FB_10Z_10A_WE-MPSB_1206; Manufacturer Part Number 1: 74279221100; Value: 74279221100; Footprint: antmicro-footprints:FB_1206_3216Metric
H1 H2 = Spacer_Drill3.7mm_H6.5mm_9774065151R: Manufacturer 1: Würth Elektronik; License: Apache-2.0; Author: Antmicro; OldValue: Spacer_Drill3.7mm_H6.5mm_9774065151R; Manufacturer Part Number 1: 9774065151R; Value: 9774065151R; Footprint: antmicro-footprints:Spacer_Drill3.7mm_H6.5mm_9774065151R
J15 = Bus_DDR4_SODIMM_CUSTOM_Jetson-Orin-H9.2mm-socket: Manufacturer 1: TE Connectivity; License: Apache-2.0; Author: Antmicro; OldValue: Bus_DDR4_SODIMM_CUSTOM_Jetson-Orin-H9.2mm-socket; Manufacturer Part Number 1: 2309413-1; Value: 2309413-1; Footprint: antmicro-footprints:TE_2309413
M1 = Jetson-Orin-NX-Nano: Manufacturer 1: Nvidia; License: Apache-2.0; Author: Antmicro; OldValue: Jetson-Orin-NX-Nano; Manufacturer Part Number 1: 900-13767-0000-000; Value: 900-13767-0000-000; Footprint: antmicro-footprints:Module_Jetson-Orin-NX-Nano
R1-R5 R11 R12 = R_0R_0402: Manufacturer 1: Panasonic; License: Apache-2.0; Tolerance: ~; Current: 1A; Author: Antmicro; OldValue: R_0R_0402; Manufacturer Part Number 1: ERJ2GE0R00X; Value: ERJ2GE0R00X; Footprint: antmicro-footprints:R_0402_1005Metric
R80 = R_4k7_0402: Manufacturer 1: Bourns; License: Apache-2.0; Tolerance: 1%; Author: Antmicro; OldValue: R_4k7_0402; Manufacturer Part Number 1: CR0402-FX-4701GLF; Value: CR0402-FX-4701GLF; Footprint: antmicro-footprints:R_0402_1005Metric
R294 = R_2k2_0402: Manufacturer 1: Bourns; License: Apache-2.0; Tolerance: 1%; Author: Antmicro; OldValue: R_2k2_0402; Manufacturer Part Number 1: CR0402-FX-2201GLF; Value: CR0402-FX-2201GLF; Footprint: antmicro-footprints:R_0402_1005Metric
S1 = SW_KMR211NGLFS_SMD: Manufacturer 1: C&K; License: Apache-2.0; Author: Antmicro; OldValue: SW_KMR211NGLFS_SMD; Manufacturer Part Number 1: KMR211NGLFS; Value: KMR211NGLFS; Footprint: antmicro-footprints:SW_KMR211NGLFS_SMD
TP2 = TP_0.75mm_SMD_3: License: Apache-2.0; Author: Antmicro; OldValue: TP_0.75mm_SMD; Value: TP_0.75mm_SMD; Footprint: antmicro-footprints:TP_SMD_0.75mm
TP3 = TP_0.75mm_SMD_1: License: Apache-2.0; Author: Antmicro; OldValue: TP_0.75mm_SMD; Value: TP_0.75mm_SMD; Footprint: antmicro-footprints:TP_SMD_0.75mm
TP4 = TP_0.75mm_SMD_5: License: Apache-2.0; Author: Antmicro; OldValue: TP_0.75mm_SMD; Value: TP_0.75mm_SMD; Footprint: antmicro-footprints:TP_SMD_0.75mm
TP5 = TP_0.75mm_SMD_4: License: Apache-2.0; Author: Antmicro; OldValue: TP_0.75mm_SMD; Value: TP_0.75mm_SMD; Footprint: antmicro-footprints:TP_SMD_0.75mm
TP35 = TP_0.75mm_SMD: License: Apache-2.0; Author: Antmicro; OldValue: TP_0.75mm_SMD; Value: TP_0.75mm_SMD; Footprint: antmicro-footprints:TP_SMD_0.75mm
TP44 = TP_0.75mm_SMD_2: License: Apache-2.0; Author: Antmicro; OldValue: TP_0.75mm_SMD; Value: TP_0.75mm_SMD; Footprint: antmicro-footprints:TP_SMD_0.75mm
U4 = NTS0102_XSON: Manufacturer 1: NXP; License: Apache-2.0; Author: Antmicro; OldValue: NTS0102_XSON; Manufacturer Part Number 1: NTS0102GT; Value: NTS0102GT; Footprint: antmicro-footprints:XSON-8_1x1.95mm_P0.5mm